# Altium schematic sheet blackfin_b_flash.SchDoc
size A3
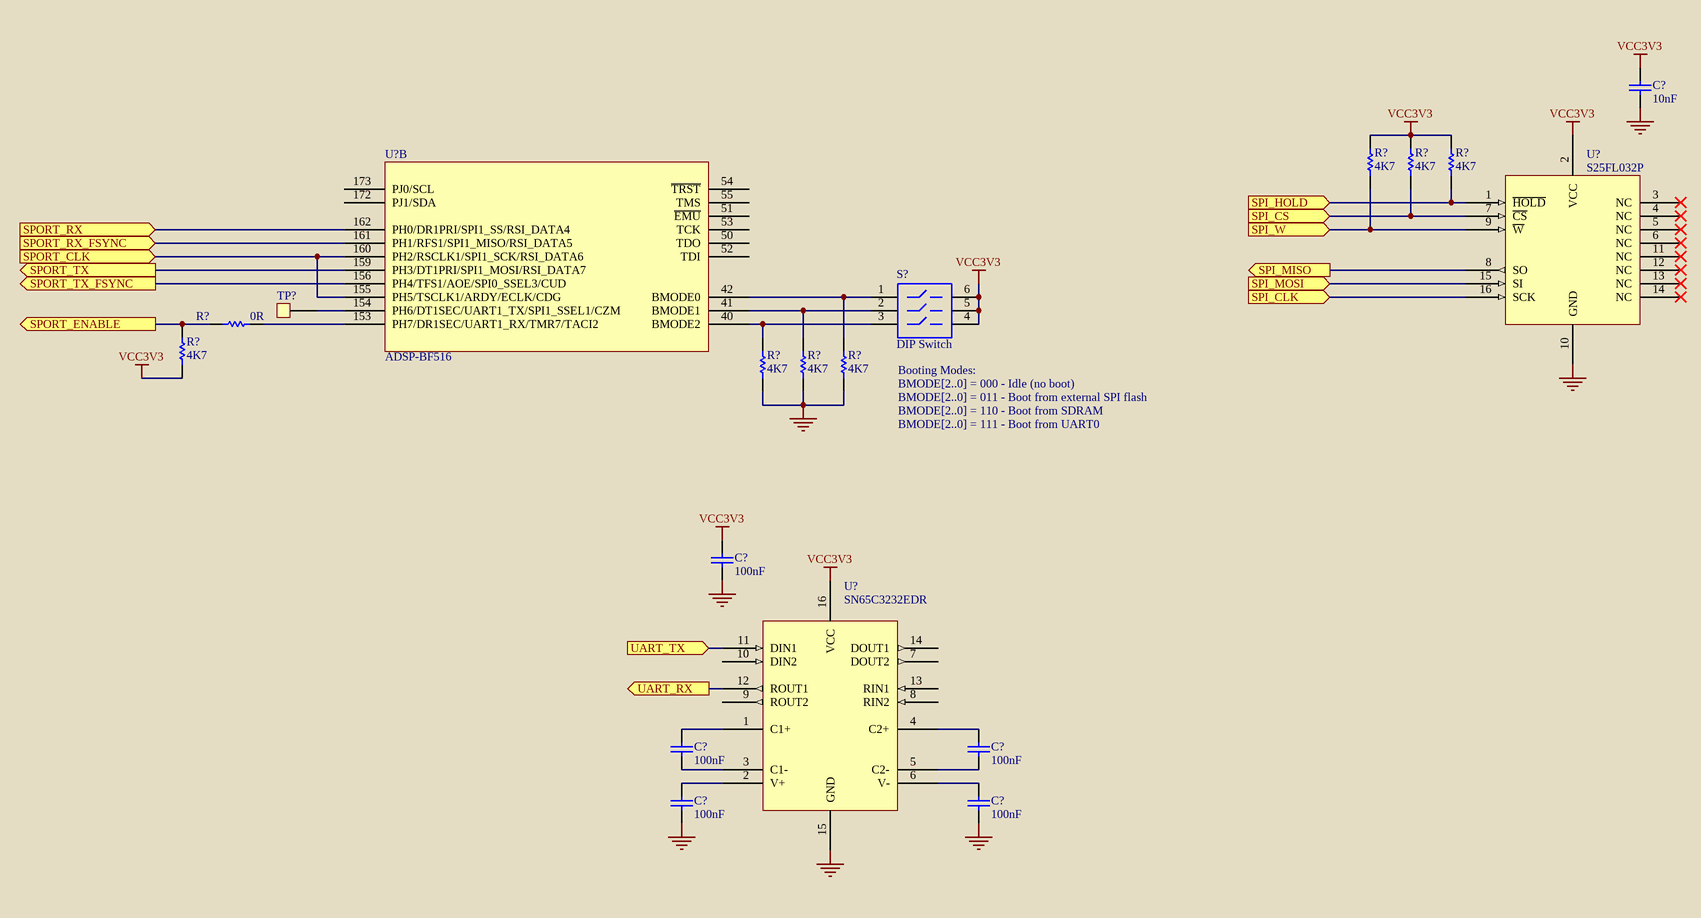
[diagram p0: blackfin_b_flash.SchDoc]

## Parts
(Parts that share a designator on the sheet are numbered #1, #2 ... from top to bottom, then left to right.)
C?#1  10nF  [C_0603]
C?#2  100nF  [C_0603]
C?#3  100nF  [C_0603]
C?#4  100nF  [C_0603]
C?#5  100nF  [C_0603]
C?#6  100nF  [C_0603]
R?#1  4K7  [R_0603]
R?#2  4K7  [R_0603]
R?#3  4K7  [R_0603]
R?#4  0R  [R_0603]
R?#5  4K7  [R_0603]
R?#6  4K7  [R_0603]
R?#7  4K7  [R_0603]
R?#8  4K7  [R_0603]
S?  DIP Switch  [DIP Switch]
TP?  Test Point  [Test Point]  (value not drawn)
U?#1  ADSP-BF516  [LQFP-176]  (part B of 4)
U?#2  S25FL032P  [SO-16]
U?#3  SN65C3232EDR  [SOIC-8]

## Ports
SPI_CLK (in), SPI_CS (in), SPI_HOLD (in), SPI_MISO (out), SPI_MOSI (in), SPI_W (in), SPORT_CLK (in), SPORT_ENABLE (out), SPORT_RX (in), SPORT_RX_FSYNC (in), SPORT_TX (out), SPORT_TX_FSYNC (out), UART_RX (out), UART_TX (in)

## Nets
GND: C?#1.1 C?#2.1 C?#5.1 C?#6.1 R?#6.1 R?#7.1 R?#8.1 U?#2.10(GND) U?#3.15(GND)
VCC3V3: C?#1.2 C?#2.2 R?#1.2 R?#2.2 R?#3.2 R?#5.1 S?.4 S?.5 S?.6 U?#2.2(VCC) U?#3.16(VCC)
SPI_CLK: U?#2.16(SCK) ; port SPI_CLK
SPI_CS: R?#2.1 U?#2.7(~{CS}) ; port SPI_CS
SPI_HOLD: R?#3.1 U?#2.1(~{HOLD}) ; port SPI_HOLD
SPI_MISO: U?#2.8(SO) ; port SPI_MISO
SPI_MOSI: U?#2.15(SI) ; port SPI_MOSI
SPI_W: R?#1.1 U?#2.9(~{W}) ; port SPI_W
SPORT_CLK: U?#1.155(PH5/TSCLK1/ARDY/ECLK/CDG) U?#1.160(PH2/RSCLK1/SPI1_SCK/RSI_DATA6) ; port SPORT_CLK
SPORT_ENABLE: R?#4.1 R?#5.2 ; port SPORT_ENABLE
SPORT_RX: U?#1.162(PH0/DR1PRI/SPI1_SS/RSI_DATA4) ; port SPORT_RX
SPORT_RX_FSYNC: U?#1.161(PH1/RFS1/SPI1_MISO/RSI_DATA5) ; port SPORT_RX_FSYNC
SPORT_TX: U?#1.159(PH3/DT1PRI/SPI1_MOSI/RSI_DATA7) ; port SPORT_TX
SPORT_TX_FSYNC: U?#1.156(PH4/TFS1/AOE/SPI0_SSEL3/CUD) ; port SPORT_TX_FSYNC
UART_RX: U?#3.12(ROUT1) ; port UART_RX
UART_TX: U?#3.11(DIN1) ; port UART_TX
NetC?#3_1: C?#3.1 U?#3.3(C1-)
NetC?#3_2: C?#3.2 U?#3.1(C1+)
NetC?#4_1: C?#4.1 U?#3.5(C2-)
NetC?#4_2: C?#4.2 U?#3.4(C2+)
NetC?#5_2: C?#5.2 U?#3.2(V+)
NetC?#6_2: C?#6.2 U?#3.6(V-)
NetR?#4_2: R?#4.2 U?#1.153(PH7/DR1SEC/UART1_RX/TMR7/TACI2)
NetR?#6_2: R?#6.2 S?.3 U?#1.40(BMODE2)
NetR?#7_2: R?#7.2 S?.2 U?#1.41(BMODE1)
NetR?#8_2: R?#8.2 S?.1 U?#1.42(BMODE0)
NetTP?_1: TP?.1 U?#1.154(PH6/DT1SEC/UART1_TX/SPI1_SSEL1/CZM)

Not connected (* = marked no-connect by the designer): U?#1 50(TDO) 51(~{EMU}) 52(TDI) 53(TCK) 54(~{TRST}) 55(TMS) 172(PJ1/SDA) 173(PJ0/SCL); U?#2 3(NC)* 4(NC)* 5(NC)* 6(NC)* 11(NC)* 12(NC)* 13(NC)* 14(NC)*; U?#3 7(DOUT2) 8(RIN2) 9(ROUT2) 10(DIN2) 13(RIN1) 14(DOUT1)

## Notes on the sheet
- Booting Modes:
- BMODE[2..0] = 000 - Idle (no boot)
- BMODE[2..0] = 011 - Boot from external SPI flash
- BMODE[2..0] = 110 - Boot from SDRAM
- BMODE[2..0] = 111 - Boot from UART0

## Library data of the parts
C?#1 = Capacitor: eVendorPart#: 77-VJ0603Y103KXAPBC; Manufacturer: Vishay/Vitramon; Part#: VJ0603Y103KXAPW1BC; eVendor: Mouser; eVendorPrice: 0,05; MSRP: 0,013; MOQ: 1000
C?#2-C?#6 = Capacitor: eVendorPart#: 81-GRM188R71E104KA01; Manufacturer: Murata; Part#: GRM188R71E104KA01J; eVendor: Mouser; eVendorPrice: 0,14; MSRP: 0,11; MOQ: 1000
R?#1-R?#3 R?#5-R?#8 = Resistor: eVendorPart#: 71-CRCW0603J-4.7K-E3; Part#: CRCW06034K70JNEA; Manufacturer: Vishay/Dale; eVendor: Mouser; eVendorPrice: 0,06; MSRP: 0,01; MOQ: 1000
R?#4 = Resistor: eVendorPart#: 71-CRCW06030000Z0EB; Part#: CRCW06030000Z0EB; Manufacturer: Vishay/Dale; eVendor: Mouser; eVendorPrice: 0,06; MSRP: 0,015; MOQ: 1000
S? = DIP Switch: eVendorPart#: 611-SDA03H1SBD; Manufacturer: C&K Components; Part#: SDA03H1SBD; eVendor: Mouser; eVendorPrice: 1,21; MSRP: 0,73; MOQ: 1000
TP? = Test Point: eVendor: NÃO SE APLICA; eVendorPrice: 0,00; eVendorPart#: NÃO SE APLICA; Part#: NÃO SE APLICA; Manufacturer: NÃO SE APLICA; MOQ: 1000; MSRP: 0,00
U?#1 = ADSP-BF516: Part#: ADSP-BF516BSWZ-3; Manufacturer: Analog Devices; eVendor: *; eVendorPart#: *; eVendorPrice: *; MOQ: *; MSRP: *
U?#2 = S25FL032P: Part#: S25FL032P0XMFI001; Manufacturer: Spansion; eVendor: Arrow; eVendorPrice: 2,10; eVendorPart#: S25FL032P0XMFI001; MOQ: 1000; MSRP: 2,10
U?#3 = RS-232 Transceiver: eVendorPart#: 595-SN65C3232EDR; Manufacturer: Texas Instruments; eVendor: Mouser; MSRP: 0,932; eVendorPrice: 1,41; Part#: SN65C3232EDR; MOQ: 1000